# EasyEDA Pro project 导航车板子.eprj

# Schematic Schematic1
Create Date: 2023-09-01; Page Name: P1; Project Name: 导航车板子; Schematic Name: Schematic1; Update Date: 2023-09-16; Company: 河北石油职业技术大学; Page Size: A4; Version: V1.0
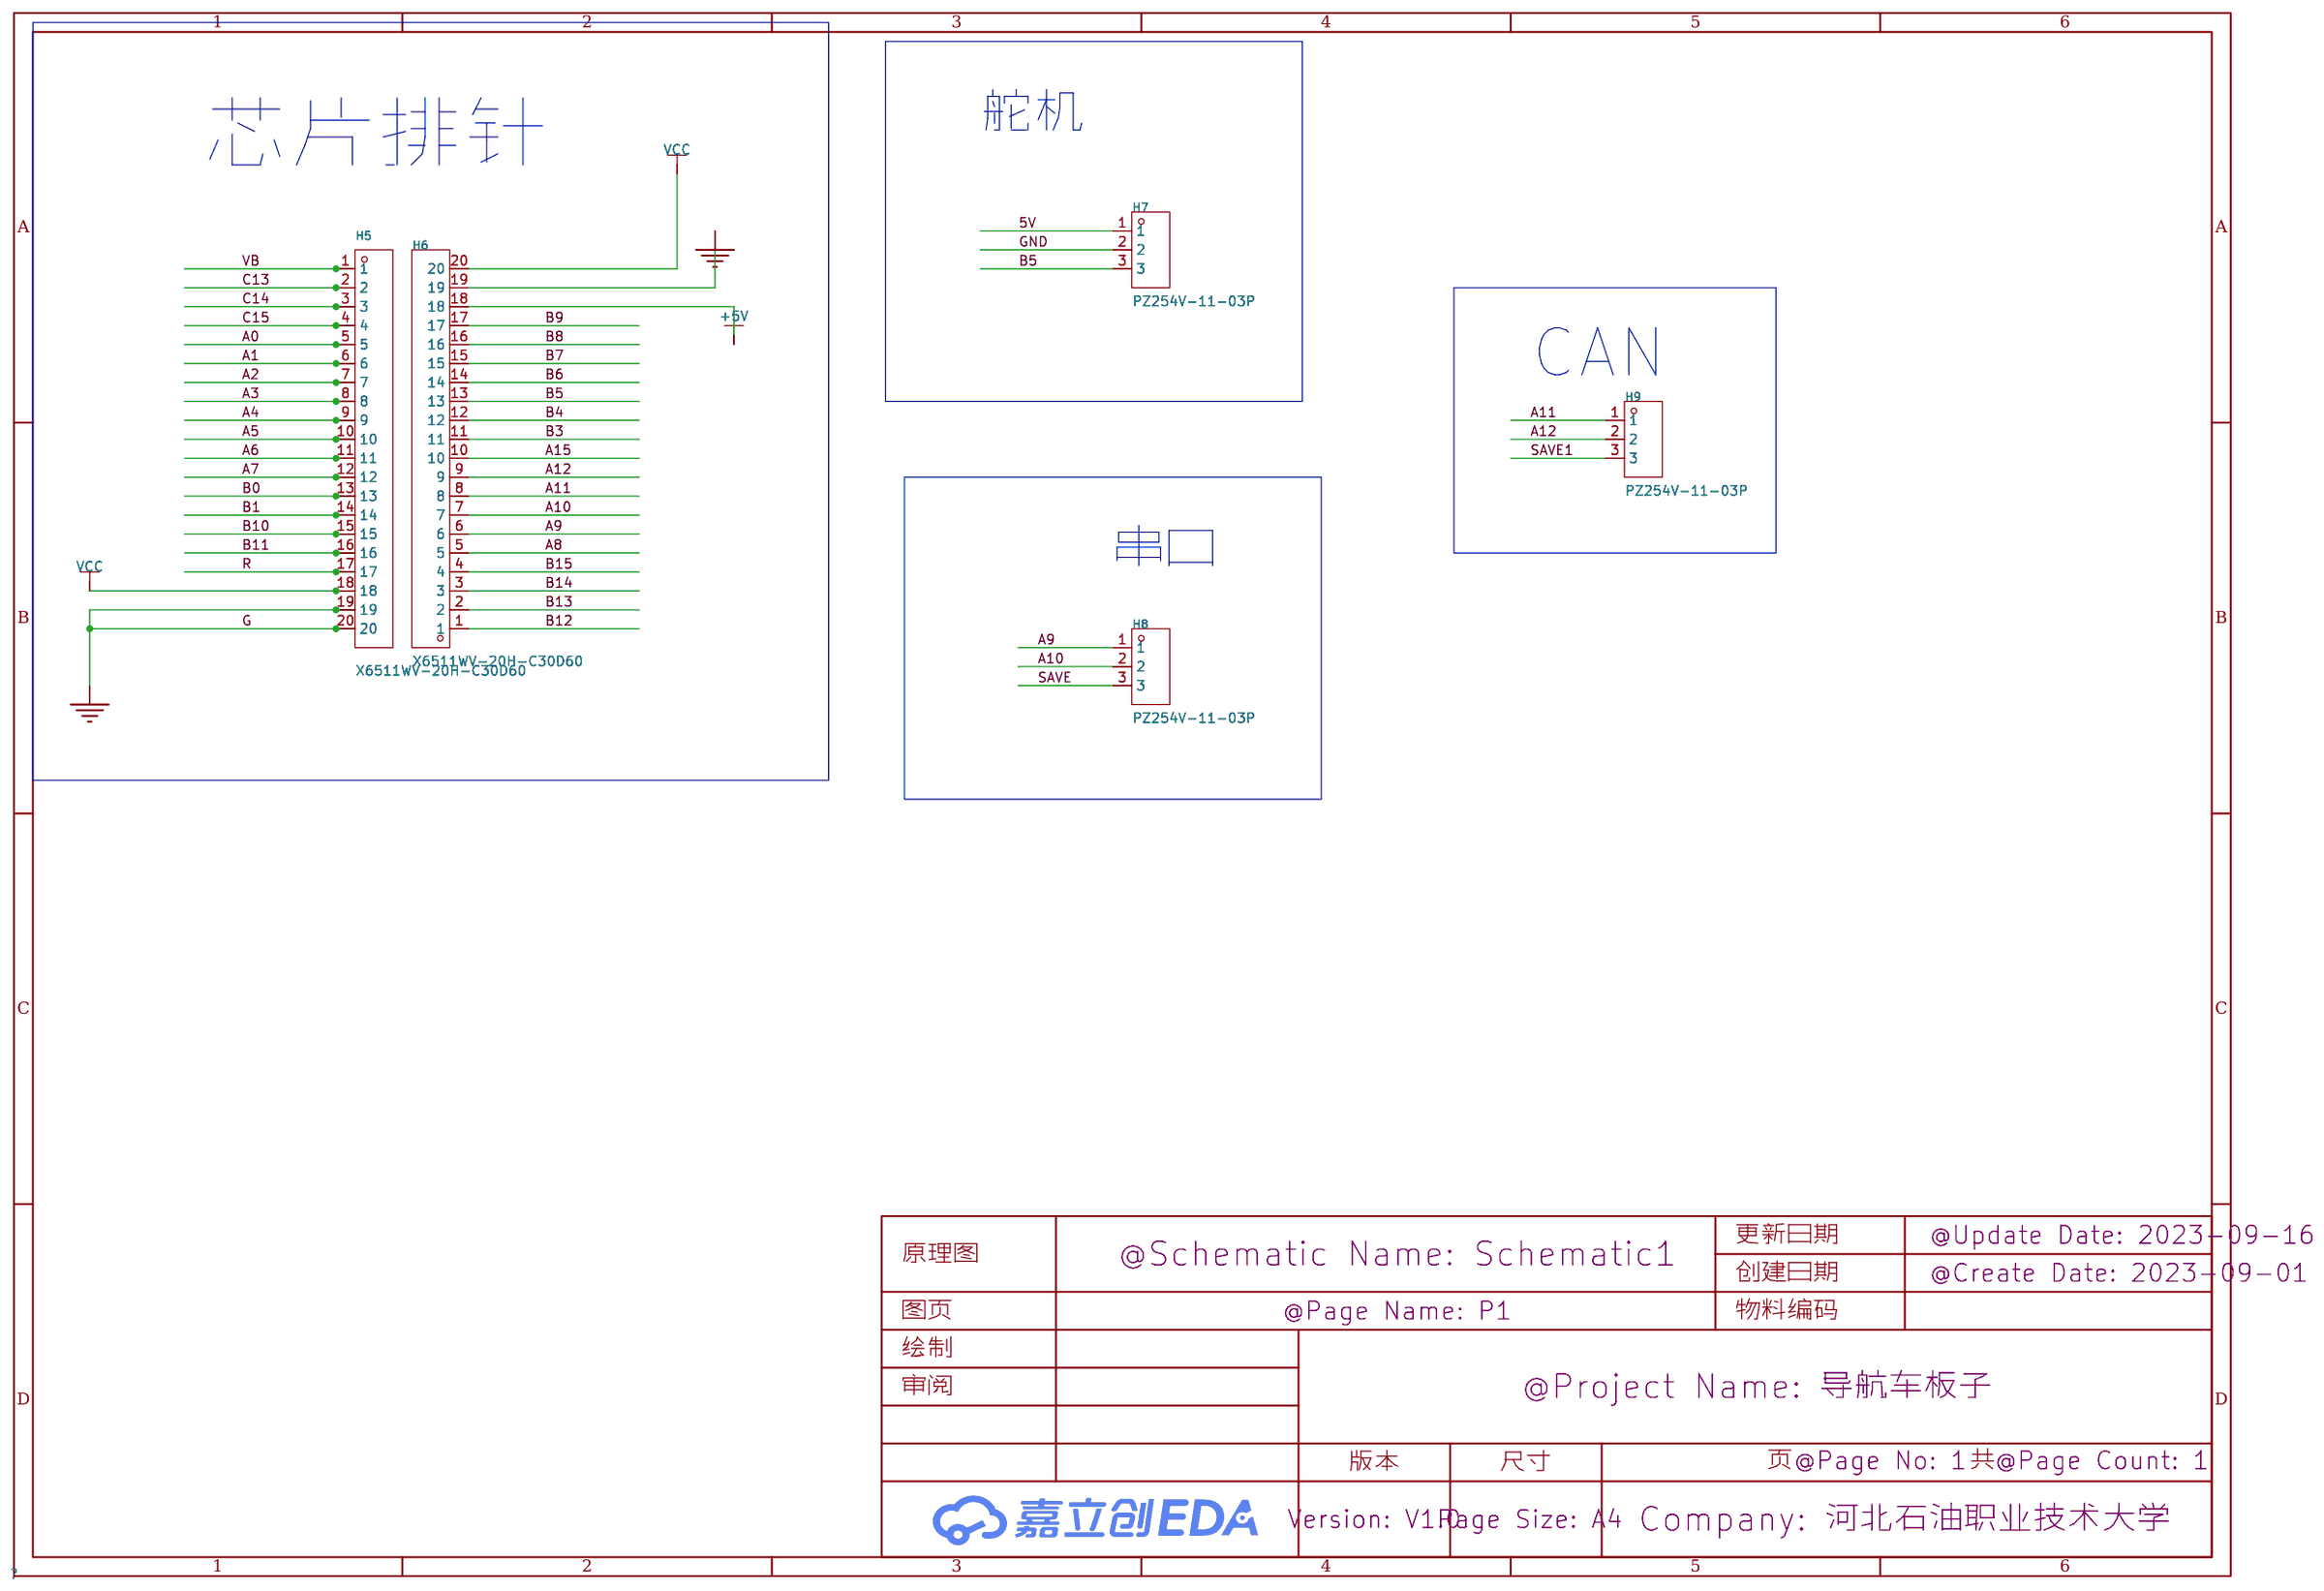
[diagram p0: schematic sheet]

## Parts
H5  X6511WV-20H-C30D60  [HDR-TH_20P-P2.54-V-M]
H6  X6511WV-20H-C30D60  [HDR-TH_20P-P2.54-V-M]
H7  PZ254V-11-03P  [HDR-TH_3P-P2.54-V-M]
H8  PZ254V-11-03P  [HDR-TH_3P-P2.54-V-M]
H9  PZ254V-11-03P  [HDR-TH_3P-P2.54-V-M]

## Library data of the parts
H5 H6 = X6511WV-20H-C30D60: 排数:单排;总PIN位数:20;间距:2.54mm;插针结构:1x20P;行距:-;安装类型:直插;圆针/方针:方针;额定电流:3A;额定电压:250V;配合针长度:6mm;塑高:2.5mm;端接针长度:3mm;触头材质:黄铜;触头镀层:金;工作温度范围:-40℃~+105℃;焊接温度(最大值):260℃;颜色:黑色;; LCSC Part Name: 2.54mm 1x20P 直插 方针; Supplier Part: C725952; Manufacturer: XKB Connectivity(中国星坤); Supplier Footprint: 插件,P=2.54mm; JLCPCB Part Class: Extended Part; Supplier: LCSC; Number of Rows: 单排; Number of Pins: 20; Pitch: 2.54mm; Pin Structure: 1x20P; Mounting Type: 直插; Circluar Pins/Square Pins: 方针; Current Rating (Max): 3A; Voltage Rating (Max): 250V; Length of Mating Pin: 6mm; Insulation Height: 2.5mm; Length of End Connection Pin: 3mm; Contact Material: 黄铜; Contact Plating: 金; Operating Temperature Range: -40℃~+105℃; Welding Temperature (Max): 260℃; Color: 黑色
H7-H9 = PZ254V-11-03P: 排数:单排;总PIN位数:3;间距:2.54mm;插针结构:1x3P;行距:-;安装类型:直插;圆针/方针:方针;额定电流:3A;额定电压:250V;配合针长度:6mm;塑高:2.5mm;端接针长度:3mm;工作温度范围:-40℃~+105℃;颜色:黑色;; LCSC Part Name: 2.54mm 1x3P 直插 方针; Supplier Part: C2937625; Manufacturer: XFCN(兴飞); Supplier Footprint: 直插,P=2.54mm; JLCPCB Part Class: Extended Part; Datasheet: 2022-07-12/581362A/62b9d00620994b3696be7eb4af85ad72/双排排针和单排排针.pdf; Supplier: LCSC; Number of Rows: 单排; Number of Pins: 3; Pitch: 2.54mm; Pin Structure: 1x3P; Mounting Type: 直插; Circluar Pins/Square Pins: 方针; Current Rating (Max): 3A; Voltage Rating (Max): 250V; Length of Mating Pin: 6mm; Insulation Height: 2.5mm; Length of End Connection Pin: 3mm; Operating Temperature Range: -40℃~+105℃; Color: 黑色

## Nets
5V: H7.1
+5V: H6.18
GND: H6.19 H7.2
VCC: H5.18 H6.20
A0: H5.5
A1: H5.6
A2: H5.7
A3: H5.8
A4: H5.9
A5: H5.10
A6: H5.11
A7: H5.12
A8: H6.5
A9: H6.6 H8.1
A10: H6.7 H8.2
A11: H6.8 H9.1
A12: H6.9 H9.2
A15: H6.10
B0: H5.13
B1: H5.14
B3: H6.11
B4: H6.12
B5: H6.13 H7.3
B6: H6.14
B7: H6.15
B8: H6.16
B9: H6.17
B10: H5.15
B11: H5.16
B12: H6.1
B13: H6.2
B14: H6.3
B15: H6.4
C13: H5.2
C14: H5.3
C15: H5.4
G: H5.19 H5.20
R: H5.17
SAVE: H8.3
SAVE1: H9.3
VB: H5.1

## Notes on the sheet
- 舵机
- 芯片排针
- CAN
- 串口

# Board PCB1
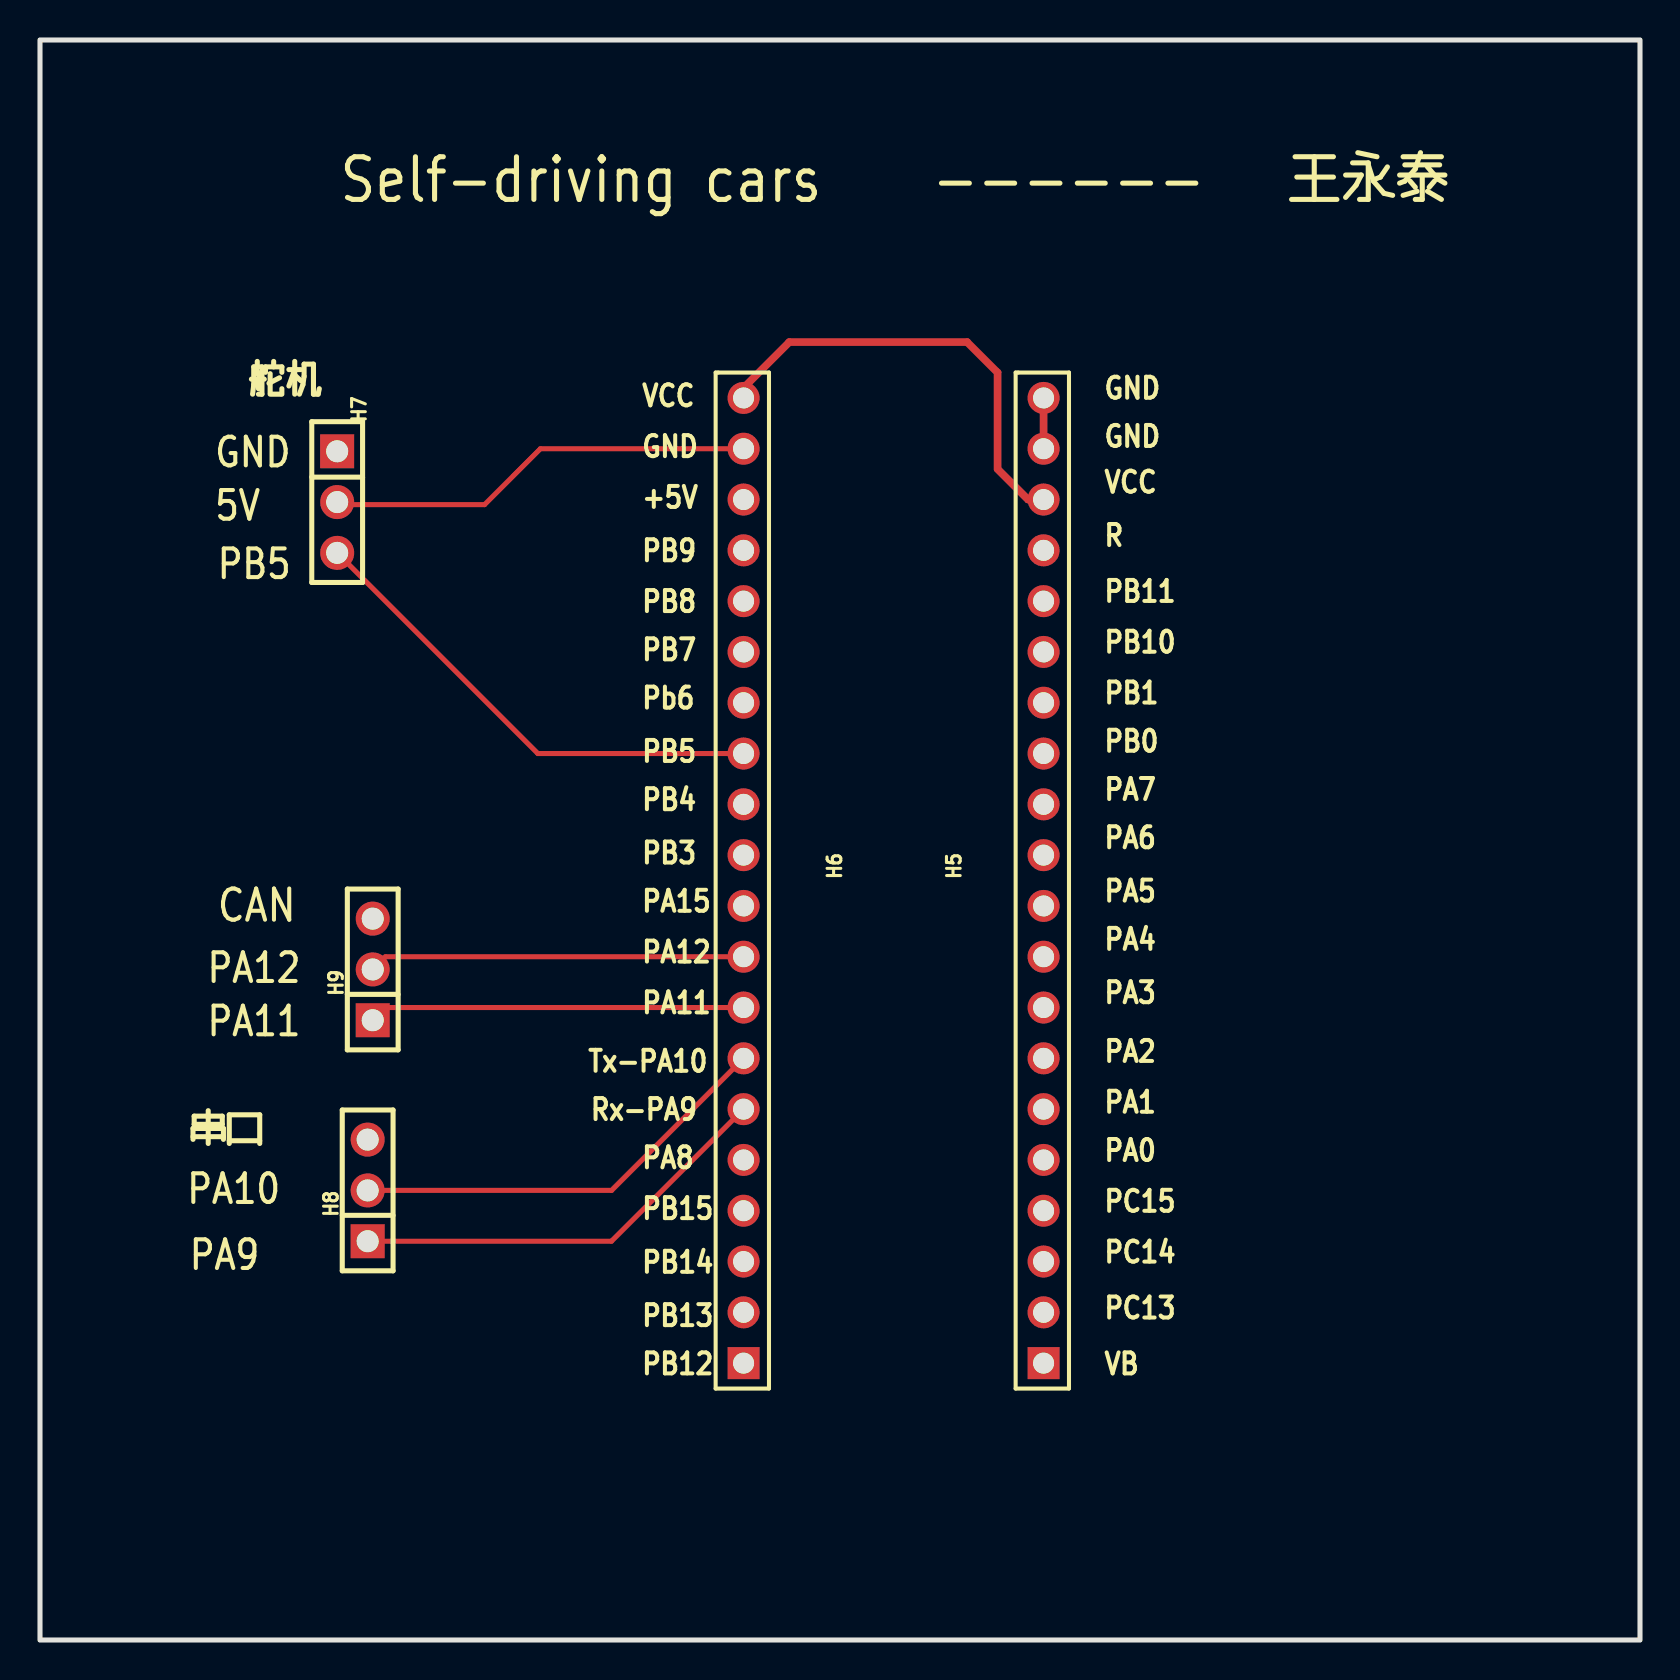
[diagram p1: board, top side]
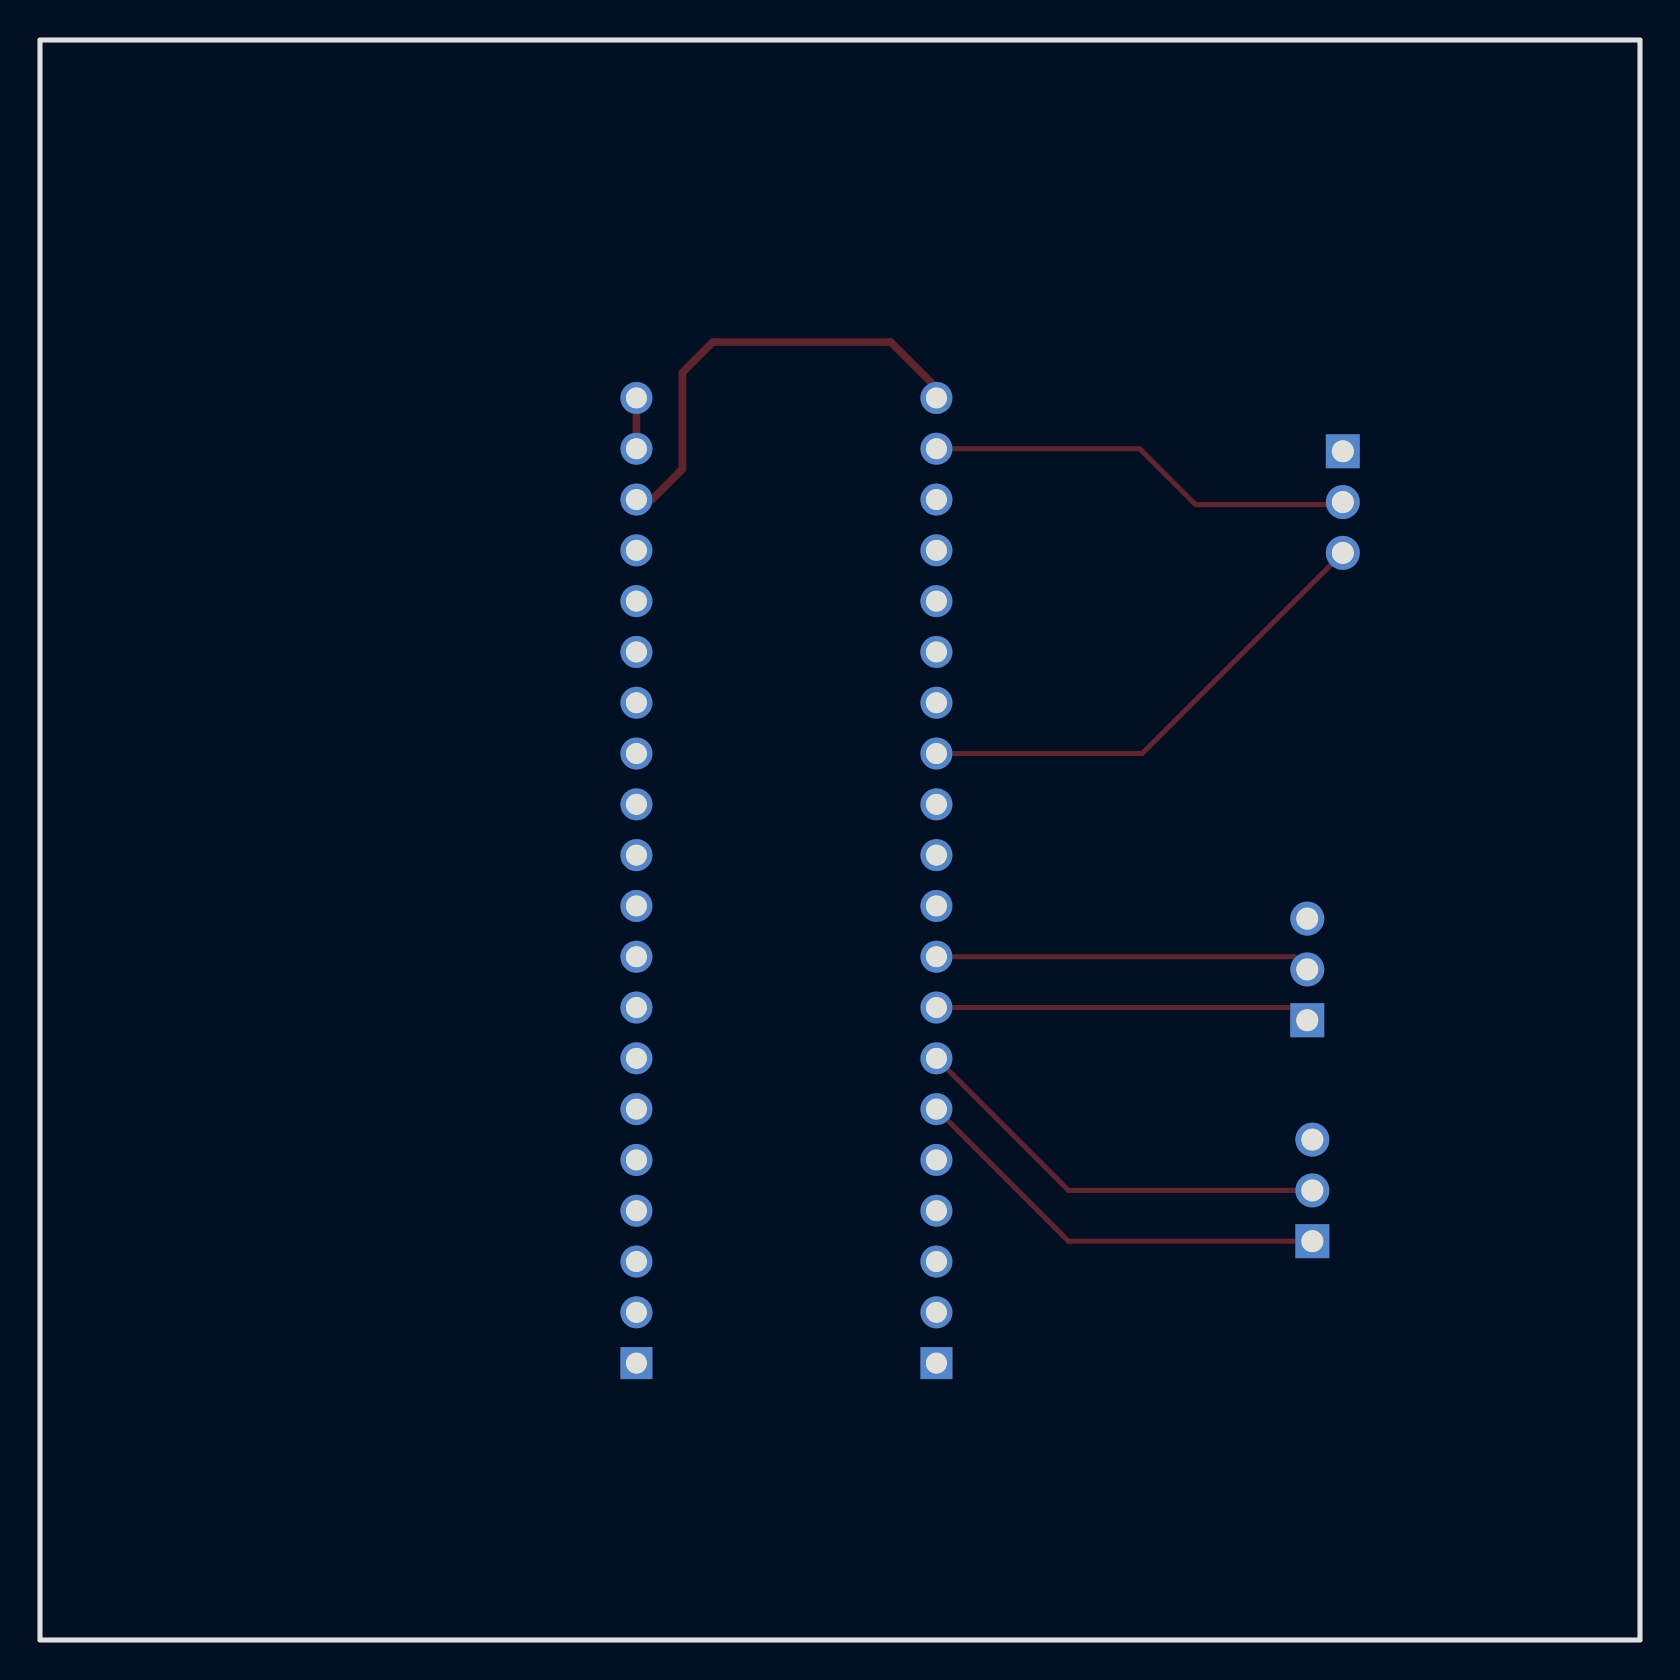
[diagram p2: board, bottom side, seen from below]

Outline 80 x 80 mm; copper layers: Top Layer, Bottom Layer. Coordinates in mm from the lower left corner of the outline.
Outline path: rectangle 0,80 80,0
Stack: Top Layer 0.035mm / Dielectric1 1.51mm FR4 er 4.5 / Bottom Layer 0.035mm

## Design rules (mm)
template: 自定义配置
spacing copperThickness1oz (default): track to track 0.152, other pairs 0.152 to 0.3
spacing copperThickness2oz: track to track 0.203, other pairs 0.152 to 0.3
track width copperThickness1oz (default): min 0.127, default 0.254, max 2.54
track width copperThickness2oz: min 0.203, default 0.254, max 2.54
differential pair differentialPair (default): width min 0.127, default 0.254, max 2.54; gap min 0.152, default 0.152
via viaSize (default): diameter min 0.5, default 0.61, max 10; hole min 0.3, default 0.305, max 6.299

## Placement (name value [footprint] x y rotation side)
H5  X6511WV-20H-C30D60  [HDR-TH_20P-P2.54-V-M]  50.18 37.97 90 top
H6  X6511WV-20H-C30D60  [HDR-TH_20P-P2.54-V-M]  35.18 37.97 90 top
H7  PZ254V-11-03P  [HDR-TH_3P-P2.54-V-M]  14.86 56.9 270 top
H8  PZ254V-11-03P  [HDR-TH_3P-P2.54-V-M]  16.38 22.48 90 top
H9  PZ254V-11-03P  [HDR-TH_3P-P2.54-V-M]  16.64 33.53 90 top

## Footprints (pads in the part's own frame, mm; a bottom-side part is the same pattern mirrored in y, then rotated)
HDR-TH_3P-P2.54-V-M
  rect 1.7x1.7 hole 1.1: 1(-2.54,0)
  round 1.7 hole 1.1: 2(0,0) 3(2.54,0)
HDR-TH_20P-P2.54-V-M
  rect 1.6x1.6 hole 1.05: 1(-24.13,0)
  round 1.6 hole 1.05: 2(-21.59,0) 3(-19.05,0) 4(-16.51,0) 5(-13.97,0) 6(-11.43,0) 7(-8.89,0) 8(-6.35,0) 9(-3.81,0) 10(-1.27,0) 11(1.27,0) 12(3.81,0) 13(6.35,0) 14(8.89,0) 15(11.43,0) 16(13.97,0) 17(16.51,0) 18(19.05,0) 19(21.59,0) 20(24.13,0)

## Nets
As in the schematic.

## Routing (per net, layer and track width the routed paths; a pad name or vN(x,y) marks a point on that pad's centre or on a via; arc(x,y) is an arc through that point)
GND: length 21.5
  Top Layer w0.254: H7.2 14.99,56.77 22.22,56.77 25.02,59.56 H6.19
A9: length 21.5
  Top Layer w0.254: H6.6 28.57,19.94 H8.1
A10: length 21.5
  Top Layer w0.254: H6.7 28.57,22.48 H8.2
A11: length 18.8
  Top Layer w0.254: 16.64,30.99 17.27,31.62 H6.8
A12: length 18.8
  Top Layer w0.254: H9.2 17.27,34.16 H6.9
B5: length 24.5
  Top Layer w0.254: H7.3 24.89,44.32 H6.13
VCC: length 22.5
  Top Layer w0.381: H6.20 35.18,62.61 37.47,64.9 46.35,64.9 47.88,63.37 47.88,58.55 49.4,57.02 H5.18
G: length 2.5
  Top Layer w0.381: H5.19 H5.20

## Text on the board
Top Silkscreen Layer: Tx-PA10 | Rx-PA9 | VCC | GND | +5V | PB9 | PB8 | PB7 | Pb6 | PB5 | PB4 | PB3 | PA15 | PA12 | PA11 | PA8 | PB15 | PB14 | PB13 | PB12 | R | PB11 | PB10 | PB1 | PB0 | PA7 | PA6 | PA5 | PA4 | PA3 | PA2 | PA1 | PA0 | PC15 | PC14 | PC13 | VB | PA10 | PA9 | 5V | CAN | 串口 | 舵机 | Self-driving cars    ------   王永泰
